# EAGLE design controller (EAGLE 9.6.2)
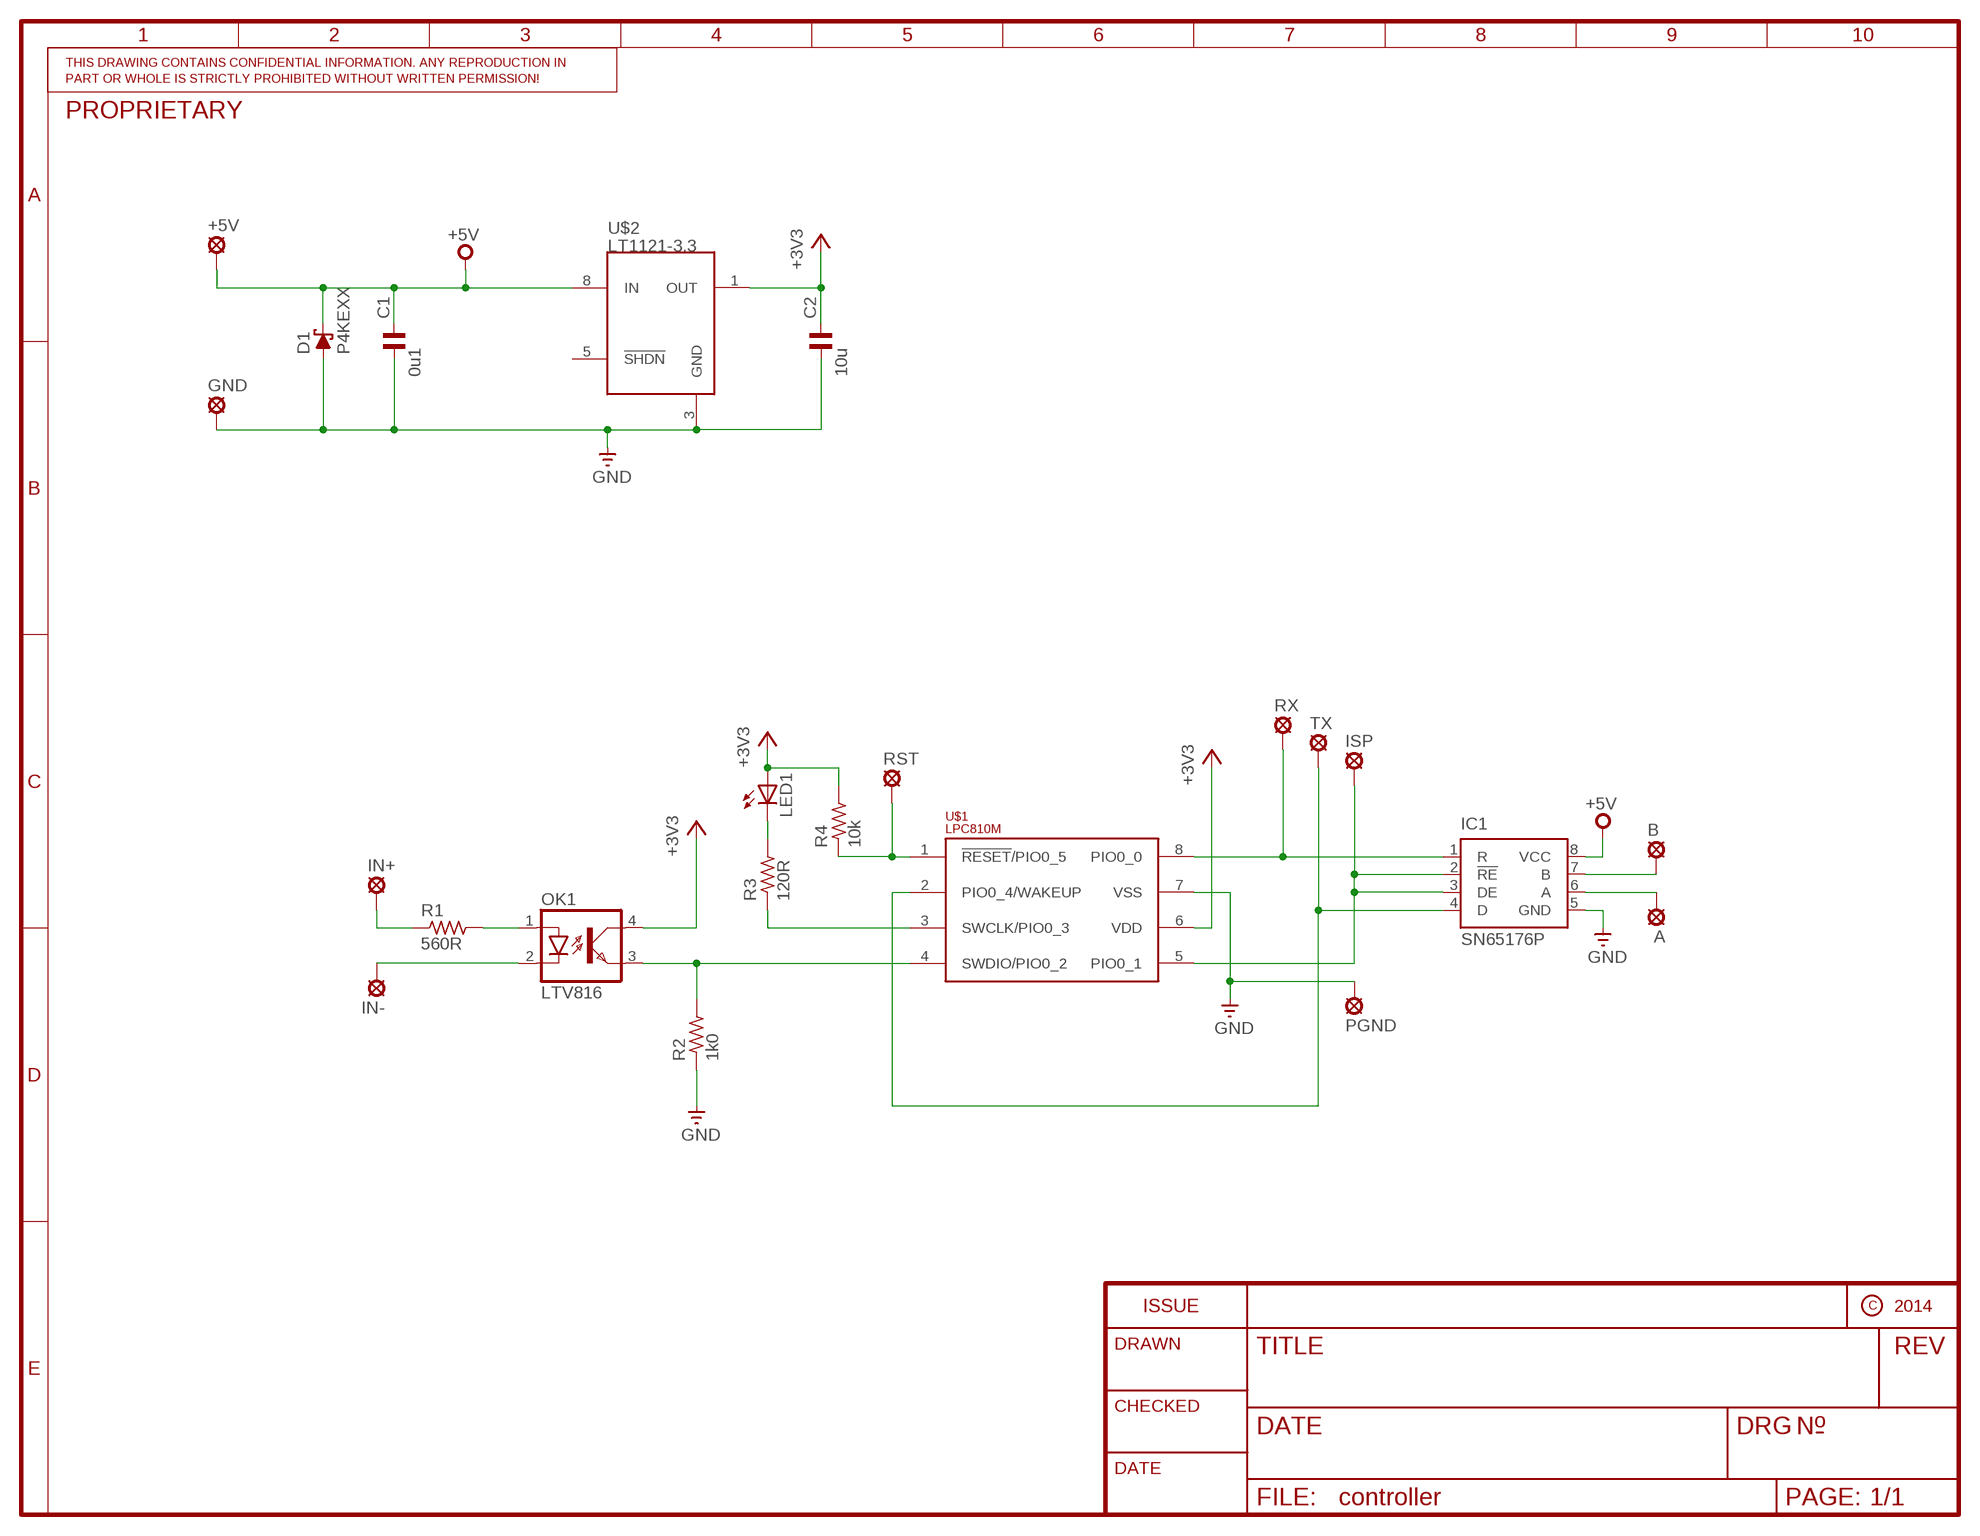
[diagram p0: schematic, sheet 1]

## Parts
+5V  SE14  [SE14]
A  SE14  [SE14]
B  SE14  [SE14]
C1  0u1  C-EU050-024X044  [C050-024X044]
C2  10u  C-EU050-024X044  [C050-024X044]
D1  P4KEXX  [DO41-10]
GND  SE14  [SE14]
IC1  SN65176P  [DIL08]
IN+  SE14  [SE14]
IN-  SE14  [SE14]
ISP  SE14  [SE14]
LED1  LED-3MM-NO_SILK  [LED3MM-NS]
OK1  LTV816  [DIL04]
PGND  SE14  [SE14]
R1  560R  R-EU_0207/10B  [0207/10B]
R2  1k0  R-EU_0207/10B  [0207/10B]
R3  120R  R-EU_0207/10B  [0207/10B]
R4  10k  R-EU_0207/10B  [0207/10B]
RST  SE14  [SE14]
RX  SE14  [SE14]
TX  SE14  [SE14]
U$1  LPC810M  [DIL08]
U$2  LT1121-3.3  [DIL08]

## Nets
+3V3: C2.1 LED1.A OK1.4(COL) R4.2 U$1.6(VDD) U$2.1(OUT)
+5V: +5V.MP C1.1 D1.C IC1.8(VCC) U$2.8(IN)
GND: C1.2 C2.2 D1.A GND.MP IC1.5(GND) PGND.MP R2.1 U$1.7(VSS) U$2.3(GND)
N$1: IC1.1(R) RX.MP U$1.8(PIO0_0)
N$2: IN+.MP R1.1
N$3: OK1.1(A) R1.2
N$4: IN-.MP OK1.2(C)
N$5: OK1.3(EMIT) R2.2 U$1.4(SWDIO/PIO0_2)
N$6: IC1.4(D) TX.MP U$1.2(PIO0_4/WAKEUP)
N$7: IC1.2(!RE) IC1.3(DE) ISP.MP U$1.5(PIO0_1)
N$8: LED1.K(C) R3.2
N$9: B.MP IC1.7(B)
N$10: A.MP IC1.6(A)
N$11: R3.1 U$1.3(SWCLK/PIO0_3)
N$12: R4.1 RST.MP U$1.1(!RESET!/PIO0_5)
Unconnected: U$2.5(!SHDN)

## Library data of the parts
+5V A B GND IN+ IN- ISP PGND RST RX TX = custom:SE14: SOLDER PAD E1553, drill 1,4mm, distributor Buerklin, 07F820
C1 C2 = custom:C-EU: CAPACITOR, European symbol
D1 = custom:P4KEXX: DIODE transient-voltage suppressor
IC1 = custom:SN65176: DIFFERENTIAL BUS TRANSCEIVER Source: http://focus.ti.com .. sn65176b.pdf; MF: TEXAS INSTRUMENTS; MPN: SN65176BP; OC_FARNELL: 1755024; OC_NEWARK: 60K6785
LED1 = custom:LED: LEDs Standard schematic elements and footprints for 5mm, 3mm, 1206, and 0603 sized LEDs. 5mm - Spark Fun Electronics SKU : COM-00529 (and others)
OK1 = custom:LTV816: OPTO COUPLER Source: LITEON, LTV816.pdf; OC_FARNELL: unknown; OC_NEWARK: unknown
R1-R4 = custom:R-EU_: RESISTOR, European symbol
U$1 = custom:LPC810M: ARM Cortex-M0 in 8-pin DIP
U$2 = custom:LT1121-3.3

## Board
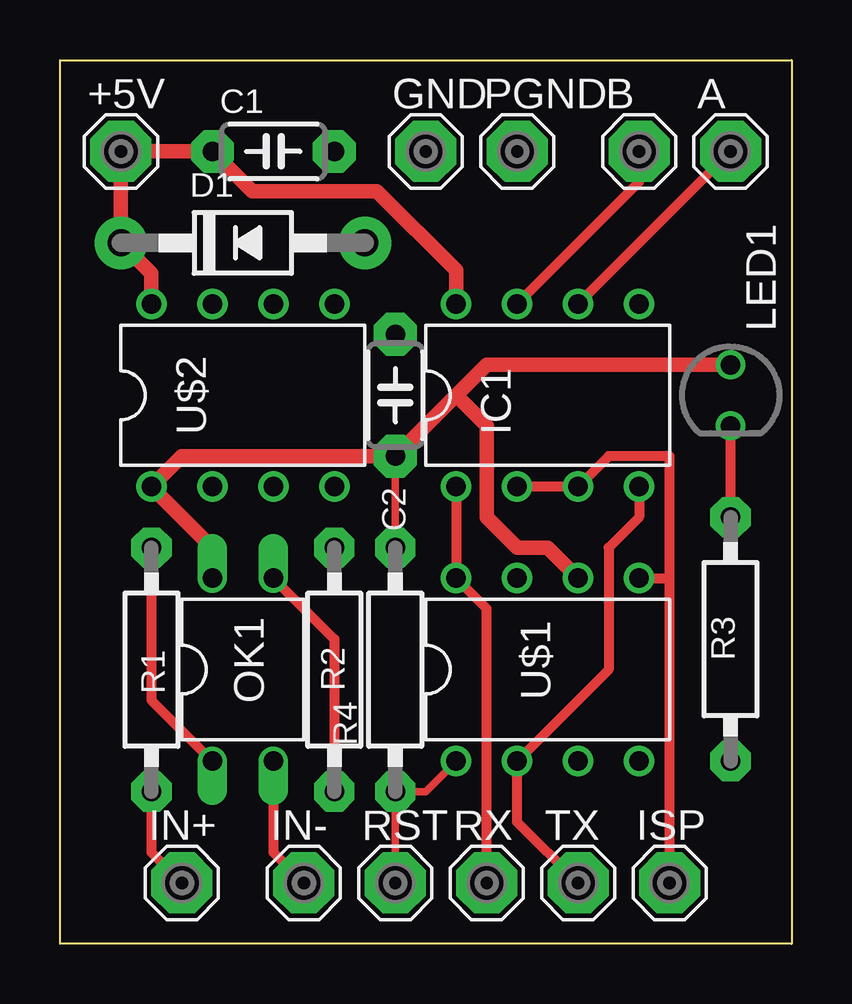
[diagram p1: board, top side]
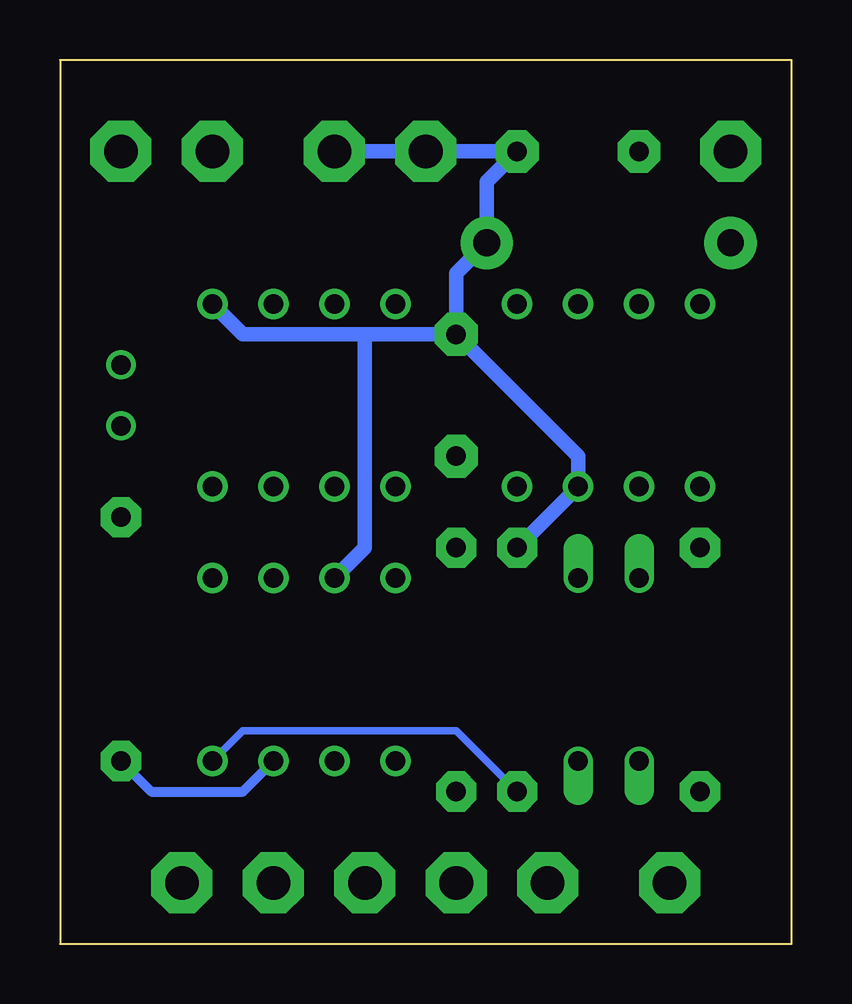
[diagram p2: board, bottom side, seen from below]

Size 30.48 x 36.83 mm. Coordinates in mm from the lower left corner, seen from the top.
Outline: 0,0 0,36.83 30.48,36.83 30.48,0 0,0
Copper layers (1*16): Top 0.035559375mm / dielectric 1.6mm / Bottom 0.035559375mm
Design rules "oshpark-2layer": minimum track width 6mil, minimum drill 10mil, track to track 6mil, track to pad 6mil, pad to pad 6mil, via to via 6mil, smd to smd 6mil, copper to edge 15mil, drill to drill 6mil, minimum pad ring 5mil, minimum via ring 5mil, stop-mask expansion 2.5mil, vias tented up to drill 0mil, thermal gap 10mil

### Footprints (pad centres in the part's own frame; a part is rotated, then mirrored left to right if it is on the bottom)
SE14 = drill 1.397 pad 2.54 octagon: MP 0,0
C050-024X044 = drill 0.813 pad 1.778 octagon: 1 -2.54,0; 2 2.54,0
DO41-10 = drill 1.118 pad 2.184: A 5.08,0; C -5.08,0
DIL08 = drill 0.813 pad 1.27: 1 -3.81,-3.81; 2 -1.27,-3.81; 3 1.27,-3.81; 4 3.81,-3.81; 5 3.81,3.81; 6 1.27,3.81; 7 -1.27,3.81; 8 -3.81,3.81
LED3MM-NS = drill 0.813: A -1.27,0; K 1.27,0
DIL04 = drill 0.813 offset: 1 -1.27,-3.81; 2 1.27,-3.81; 3 1.27,3.81; 4 -1.27,3.81
0207/10B = drill 0.813 pad 1.676 octagon: 1 -5.08,0; 2 5.08,0

### Placement (x,y rotation side)
+5V  2.54,33.02 0 top
A  27.94,33.02 0 top
B  24.13,33.02 0 top
C1  8.89,33.02 0 top
C2  13.97,22.86 90 top
D1  7.62,29.21 0 top
GND  15.24,33.02 0 top
IC1  20.32,22.86 0 top
IN+  5.08,2.54 0 top
IN-  10.16,2.54 0 top
ISP  25.4,2.54 0 top
LED1  27.94,22.86 270 top
OK1  7.62,11.43 0 top
PGND  19.05,33.02 0 top
R1  3.81,11.43 90 top
R2  11.43,11.43 270 top
R3  27.94,12.7 90 top
R4  13.97,11.43 90 top
RST  13.97,2.54 0 top
RX  17.78,2.54 0 top
TX  21.59,2.54 0 top
U$1  20.32,11.43 0 top
U$2  7.62,22.86 0 top

### Tracks (layer width: path | path; a pad name or v marks a point on that pad's centre or on a via)
+3V3
  Top 0.305: R4.2 C2.1
  Top 0.61: OK1.4 6.35,16.51 U$2.1 5.08,20.32 C2.1 16.51,22.86 | 16.51,22.86 17.78,24.13 LED1.A | 16.51,22.86 17.78,21.59 17.78,17.78 19.05,16.51 20.32,16.51 U$1.6
+5V
  Top 0.61: U$2.8 3.81,27.94 D1.C +5V.MP C1.1 8,31.37 13.21,31.37 16.51,28.07 IC1.8
GND
  Bottom 0.61: C2.2 13.97,27.94 D1.A 12.7,31.75 C1.2 GND.MP PGND.MP | C2.2 8.89,20.32 U$2.3 R2.1 | IC1.5 22.86,25.4 17.78,25.4 | 17.78,25.4 C2.2 | 17.78,25.4 17.78,16.51 U$1.7
N$1
  Top 0.406: RX.MP 17.78,13.97 U$1.8 IC1.1
N$2
  Top 0.406: R1.1 3.81,3.81 IN+.MP
N$3
  Top 0.406: R1.2 3.81,10.16 OK1.1
N$4
  Top 0.406: OK1.2 8.89,3.81 IN-.MP
N$5
  Top 0.406: OK1.3 11.43,12.7 R2.2
  Bottom 0.305: R2.2 13.97,8.89 22.86,8.89 U$1.4
N$6
  Top 0.406: TX.MP 19.05,5.08 U$1.2 22.86,11.43 22.86,16.51 24.13,17.78 IC1.4
N$7
  Top 0.406: ISP.MP 25.4,15.24 | 25.4,15.24 25.4,20.32 22.86,20.32 IC1.3 IC1.2 | U$1.5 25.4,15.24
N$8
  Top 0.406: R3.2 LED1.K
N$9
  Top 0.406: B.MP 24.13,31.75 IC1.7
N$10
  Top 0.406: A.MP IC1.6
N$11
  Bottom 0.406: R3.1 26.67,6.35 22.86,6.35 U$1.3
N$12
  Top 0.305: U$1.1 15.24,6.35 R4.1 RST.MP